# Altium schematic sheet 0_RKSTM32_Overview.SchDoc
size A4; SheetNumber: 1; SheetTotal: 4
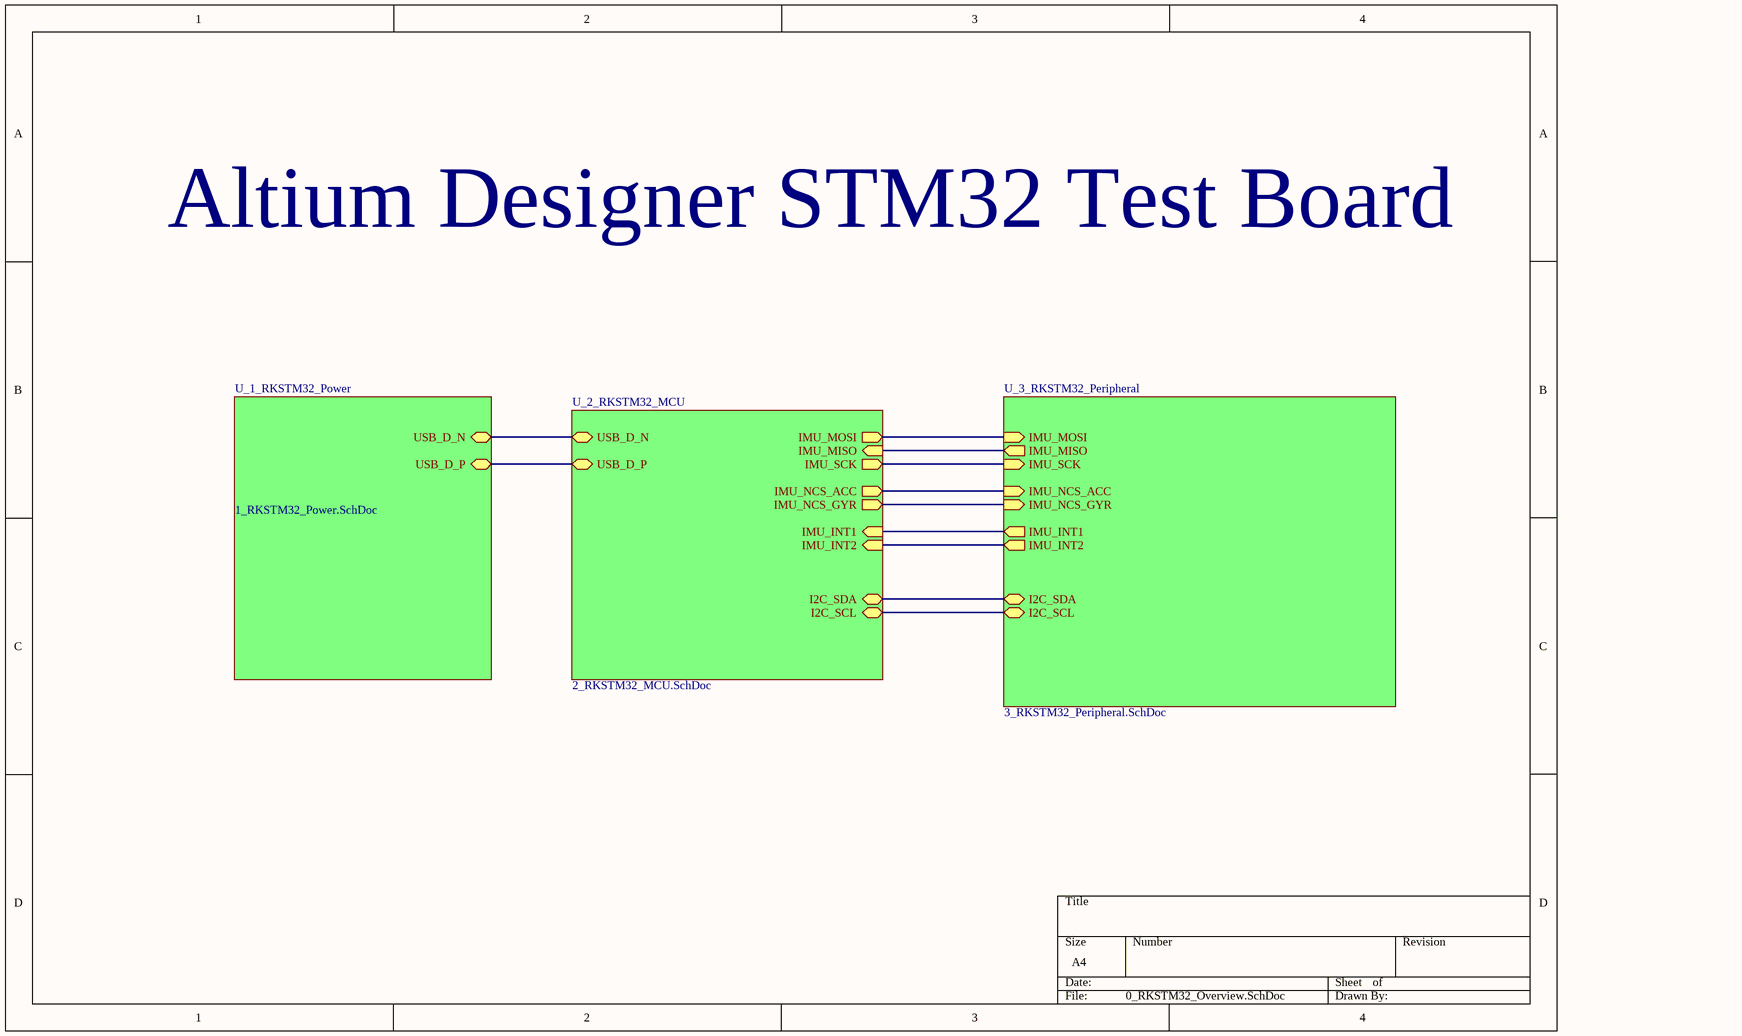
[diagram p0: 0_RKSTM32_Overview.SchDoc]

## Sub-sheets
U_1_RKSTM32_Power = 1_RKSTM32_Power.SchDoc: USB_D_N (bidir), USB_D_P (bidir)
U_2_RKSTM32_MCU = 2_RKSTM32_MCU.SchDoc: USB_D_P (bidir), USB_D_N (bidir), IMU_MOSI (out), IMU_MISO (in), IMU_SCK (out), IMU_NCS_ACC (out), IMU_NCS_GYR (out), IMU_INT1 (in), IMU_INT2 (in), I2C_SDA (bidir), I2C_SCL (bidir)
U_3_RKSTM32_Peripheral = 3_RKSTM32_Peripheral.SchDoc: I2C_SDA (bidir), IMU_INT1 (out), IMU_INT2 (out), IMU_MOSI (in), IMU_MISO (out), IMU_SCK (in), IMU_NCS_ACC (in), IMU_NCS_GYR (in), I2C_SCL (bidir)

## Nets
(unnamed): sheet U_1_RKSTM32_Power/USB_D_N, sheet U_2_RKSTM32_MCU/USB_D_N
(unnamed): sheet U_1_RKSTM32_Power/USB_D_P, sheet U_2_RKSTM32_MCU/USB_D_P
(unnamed): sheet U_2_RKSTM32_MCU/IMU_MOSI, sheet U_3_RKSTM32_Peripheral/IMU_MOSI
(unnamed): sheet U_2_RKSTM32_MCU/IMU_MISO, sheet U_3_RKSTM32_Peripheral/IMU_MISO
(unnamed): sheet U_2_RKSTM32_MCU/IMU_SCK, sheet U_3_RKSTM32_Peripheral/IMU_SCK
(unnamed): sheet U_2_RKSTM32_MCU/IMU_NCS_ACC, sheet U_3_RKSTM32_Peripheral/IMU_NCS_ACC
(unnamed): sheet U_2_RKSTM32_MCU/IMU_NCS_GYR, sheet U_3_RKSTM32_Peripheral/IMU_NCS_GYR
(unnamed): sheet U_2_RKSTM32_MCU/IMU_INT1, sheet U_3_RKSTM32_Peripheral/IMU_INT1
(unnamed): sheet U_2_RKSTM32_MCU/IMU_INT2, sheet U_3_RKSTM32_Peripheral/IMU_INT2
(unnamed): sheet U_2_RKSTM32_MCU/I2C_SDA, sheet U_3_RKSTM32_Peripheral/I2C_SDA
(unnamed): sheet U_2_RKSTM32_MCU/I2C_SCL, sheet U_3_RKSTM32_Peripheral/I2C_SCL

## Notes on the sheet
- Altium Designer STM32 Test Board